# EasyEDA schematic Power_logger_diy_current_voltage_sensors.json
TITLE: Sheet_1; REV: 1.0; Date: 2021-02-10; Sheet: 1/1; Company: Your Company
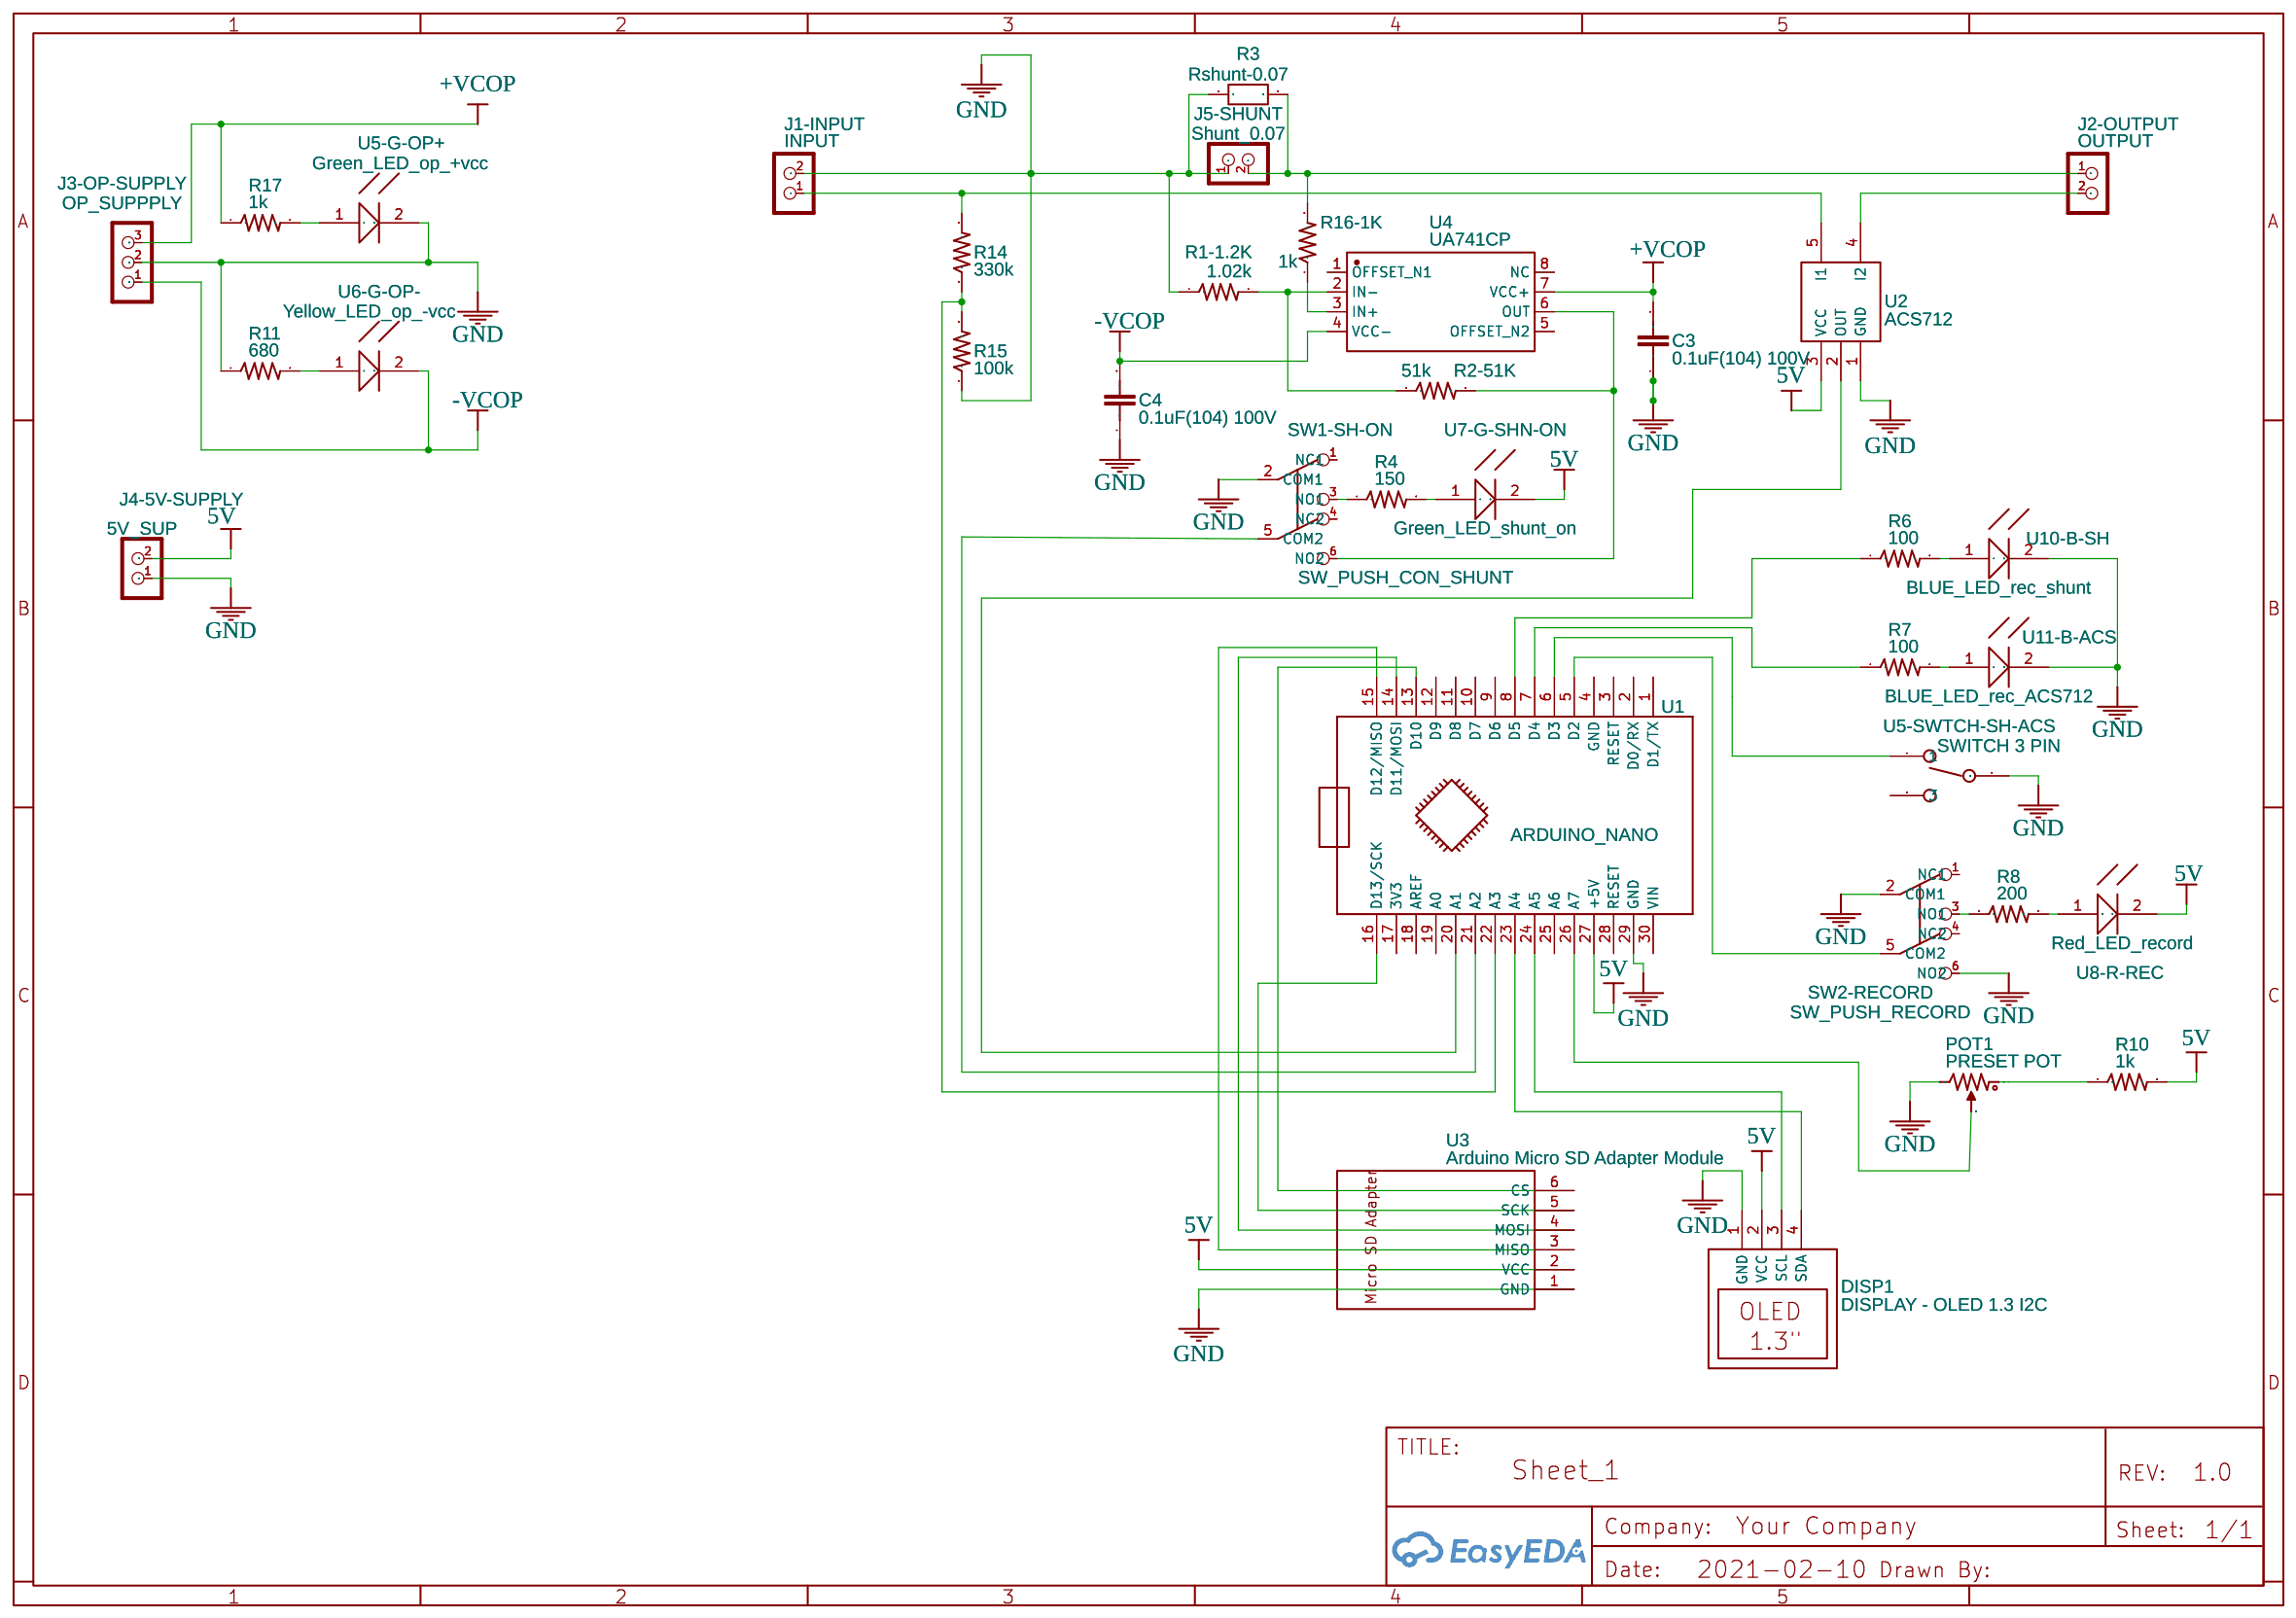
[diagram p0: schematic sheet]

## Parts
C3  0.1uF(104) 100V  [CAPACITOR CERAMIC TH 0.1]
C4  0.1uF(104) 100V  [CAPACITOR CERAMIC TH 0.1]
DISP1  DISPLAY - OLED 1.3 I2C  [DISPLAY - OLED 1.3 I2C]
J1-INPUT  INPUT  [TERMINAL_BLOCK_2P_5]
J2-OUTPUT  OUTPUT  [TERMINAL_BLOCK_2P_5]
J3-OP-SUPPLY  OP_SUPPPLY  [TERMINAL_BLOCK_3P_5]
J4-5V-SUPPLY  5V_SUP  [TERMINAL_BLOCK_2P_5]
J5-SHUNT  Shunt_0.07  [TERMINAL_BLOCK_2P_5]
POT1  PRESET POT  [PRESET]
R1-1.2K  1.02k  [AXIAL-0.3-KIT]
R2-51K  51k  [AXIAL-0.3-KIT]
R3  Rshunt-0.07  [AXIAL-1.0]
R4  150  [AXIAL-0.3-KIT]
R6  100  [AXIAL-0.3-KIT]
R7  100  [AXIAL-0.3-KIT]
R8  200  [AXIAL-0.3-KIT]
R10  1k  [AXIAL-0.3-KIT]
R11  680  [AXIAL-0.3-KIT]
R14  330k  [AXIAL-0.3-KIT]
R15  100k  [AXIAL-0.3-KIT]
R16-1K  1k  [AXIAL-0.3-KIT]
R17  1k  [AXIAL-0.3-KIT]
SW1-SH-ON  SW_PUSH_CON_SHUNT  [SW_PUSH_BUTTON_MINI]
SW2-RECORD  SW_PUSH_RECORD  [SW_PUSH_BUTTON_MINI]
U1  ARDUINO_NANO  [ARDUINO_NANO]
U2  ACS712  [ACS712]
U3  Arduino Micro SD Adapter Module  [ARDUINO MICRO SD ADAPTER MODULE]
U4  UA741CP  [DIP-8_L10.1-W6.3-P2.54-LS7.6-BL]
U5-G-OP+  Green_LED_op_+vcc  [DIOAD254W50D410H510]
U5-SWTCH-SH-ACS  SWITCH 3 PIN  [HEADER 3 PIN]
U6-G-OP-  Yellow_LED_op_-vcc  [DIOAD254W50D410H510]
U7-G-SHN-ON  Green_LED_shunt_on  [DIOAD254W50D410H510]
U8-R-REC  Red_LED_record  [DIOAD254W50D410H510]
U10-B-SH  BLUE_LED_rec_shunt  [DIOAD254W50D410H510]
U11-B-ACS  BLUE_LED_rec_ACS712  [DIOAD254W50D410H510]

## Library data of the parts
C3 C4 = Capacitor Ceramic TH 0.1: Mounting: TH; Pin Centres: 0.1; Manufacturer Part: ?; Contributor: MelDuckmanton
DISP1 = DISPLAY - OLED 1.3 I2C: Contributor: jettetsoi; Package Display: No
J1-INPUT J2-OUTPUT = CON_TERMINAL_BLOCK_02: Contributor: DangerousPrototype; Package Display: No
J3-OP-SUPPLY = CON_TERMINAL_BLOCK_03: Contributor: DangerousPrototype
J4-5V-SUPPLY J5-SHUNT = CON_TERMINAL_BLOCK_02: Contributor: DangerousPrototype
POT1 = PRESET POT: Contributor: roberto26
R1-1.2K R2-51K R4 R6-R8 R10 R11 R14 R15 R16-1K R17 = RESISTORKIT: Resistor; Contributor: SparkFun
R3 = Res_AXIAL-1.0(3W)_EU: Package Display: No
SW1-SH-ON SW2-RECORD = SW_PUSH_DPDT: Contributor: DangerousPrototype
U1 = ARDUINO_NANO: sourceId: KGSeAWhDB
U2 = ACS712: Contributor: Ronald Rezal
U3 = Arduino Micro SD Adapter Module: Contributor: spicypepper53
U4 = UA741CP: Supplier: LCSC; Manufacturer: TI; image: //image.lceda.cn/szlcsc/C78758.jpg; Supplier Part: C78758
U5-G-OP+ U6-G-OP- U7-G-SHN-ON U8-R-REC U10-B-SH U11-B-ACS = Red LED: Manufacturer: MULTICOMP PRO; Manufacturer Part: 703-0090; Supplier: Element14; Supplier Part: 2112100; link: http://www.farnell.com/datasheets/2863873.pdf; Contributor: 19049090
U5-SWTCH-SH-ACS = SWITCH 3 PIN: Manufacturer Part: SWITCH; Supplier Part: SWITCH symbol; Supplier: Io; link: none; Contributor: pippu

## Nets
5V: DISP1.2(VCC) J4-5V-SUPPLY.2 R10.2 U1.27(+5V) U2.3(VCC) U3.2(VCC) U7-G-SHN-ON.2 U8-R-REC.2
GND: C3.1 C4.1 DISP1.1(GND) J1-INPUT.2 J3-OP-SUPPLY.2 J4-5V-SUPPLY.1 J5-SHUNT.1 POT1.3 R1-1.2K.1 R3.1 R11.1 R15.1 SW1-SH-ON.2(COM1) SW2-RECORD.2(COM1) SW2-RECORD.6(NO2) U1.29(GND) U2.1(GND) U3.1(GND) U5-G-OP+.2 U5-SWTCH-SH-ACS.2 U10-B-SH.2 U11-B-ACS.2
+VCOP: C3.2 J3-OP-SUPPLY.3 R17.1 U4.7(VCC+)
-VCOP: C4.2 J3-OP-SUPPLY.1 U4.4(VCC-) U6-G-OP-.2
Net-(DISP1-3): DISP1.3(SCL) U1.24(A5)
Net-(DISP1-4): DISP1.4(SDA) U1.23(A4)
Net-(J1-INPUT-1): J1-INPUT.1 R14.2 U2.5(I1)
Net-(J2-OUTPUT-1): J2-OUTPUT.1 J5-SHUNT.2 R3.2 R16-1K.2
Net-(J2-OUTPUT-2): J2-OUTPUT.2 U2.4(I2)
Net-(POT1-1): POT1.1 R10.1
Net-(POT1-2): POT1.2 U1.26(A7)
Net-(R1-1.2K-2): R1-1.2K.2 R2-51K.1 U4.2(IN-)
Net-(R2-51K-2): R2-51K.2 SW1-SH-ON.6(NO2) U4.6(OUT)
Net-(R4-1): R4.1 SW1-SH-ON.3(NO1)
Net-(R4-2): R4.2 U7-G-SHN-ON.1
Net-(R6-1): R6.1 U1.8(D5)
Net-(R6-2): R6.2 U10-B-SH.1
Net-(R7-1): R7.1 U1.7(D4)
Net-(R7-2): R7.2 U11-B-ACS.1
Net-(R8-1): R8.1 SW2-RECORD.3(NO1)
Net-(R8-2): R8.2 U8-R-REC.1
Net-(R11-2): R11.2 U6-G-OP-.1
Net-(R14-1): R14.1 R15.2 U1.22(A3)
Net-(R16-1K-1): R16-1K.1 U4.3(IN+)
Net-(R17-2): R17.2 U5-G-OP+.1
Net-(SW1-SH-ON-5): SW1-SH-ON.5(COM2) U1.21(A2)
Net-(SW2-RECORD-5): SW2-RECORD.5(COM2) U1.5(D2)
Net-(U1-6): U1.6(D3) U5-SWTCH-SH-ACS.1
Net-(U1-13): U1.13(D10) U3.6(CS)
Net-(U1-14): U1.14(D11/MOSI) U3.4(MOSI)
Net-(U1-15): U1.15(D12/MISO) U3.3(MISO)
Net-(U1-16): U1.16(D13/SCK) U3.5(SCK)
Net-(U1-20): U1.20(A1) U2.2(OUT)

Not connected (* = marked no-connect by the designer): SW1-SH-ON 1(NC1) 4(NC2); SW2-RECORD 1(NC1) 4(NC2); U1 1(D1/TX) 2(D0/RX) 3(RESET) 4(GND) 9(D6) 10(D7) 11(D8) 12(D9) 17(3V3) 18(AREF) 19(A0) 25(A6) 28(RESET) 30(VIN); U4 1(OFFSET_N1) 5(OFFSET_N2) 8(NC); U5-SWTCH-SH-ACS 3
